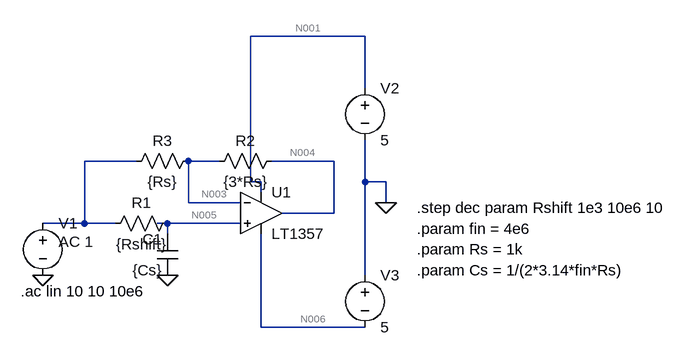
[diagram p0: schematic Draft7.asc]
Draft7.asc, the LTspice schematic file:
Version 4
SHEET 1 936 680
WIRE 400 -128 224 -128
WIRE 400 -48 400 -128
WIRE 48 64 -32 64
WIRE 176 64 128 64
WIRE 352 64 256 64
WIRE 224 96 224 -128
WIRE 240 96 224 96
WIRE 400 96 400 32
WIRE 432 96 400 96
WIRE 240 112 240 96
WIRE 128 128 128 64
WIRE 208 128 128 128
WIRE 432 128 432 96
WIRE 352 144 352 64
WIRE 352 144 272 144
WIRE -32 160 -32 64
WIRE -32 160 -96 160
WIRE 16 160 -32 160
WIRE 96 160 80 160
WIRE 208 160 96 160
WIRE 96 176 96 160
WIRE 400 240 400 96
WIRE 240 320 240 176
WIRE 400 320 240 320
FLAG -96 240 0
FLAG 96 240 0
FLAG 432 128 0
SYMBOL cap 112 240 R180
WINDOW 0 24 56 Left 2
WINDOW 3 24 8 Left 2
SYMATTR InstName C1
SYMATTR Value {Cs}
SYMBOL res 112 144 R90
WINDOW 0 0 56 VBottom 2
WINDOW 3 32 56 VTop 2
SYMATTR InstName R1
SYMATTR Value {Rshift}
SYMBOL voltage -96 144 R0
WINDOW 3 24 96 Invisible 2
WINDOW 123 24 44 Left 2
WINDOW 39 0 0 Left 0
SYMATTR InstName V1
SYMATTR Value SINE(0 1 {fin})
SYMATTR Value2 AC 1
SYMBOL OpAmps\\LT1357 240 80 R0
SYMATTR InstName U1
SYMBOL res 272 48 R90
WINDOW 0 0 56 VBottom 2
WINDOW 3 32 56 VTop 2
SYMATTR InstName R2
SYMATTR Value {3*Rs}
SYMBOL res 144 48 R90
WINDOW 0 0 56 VBottom 2
WINDOW 3 32 56 VTop 2
SYMATTR InstName R3
SYMATTR Value {Rs}
SYMBOL voltage 400 -64 R0
WINDOW 123 0 0 Left 0
WINDOW 39 0 0 Left 0
SYMATTR InstName V2
SYMATTR Value 5
SYMBOL voltage 400 224 R0
WINDOW 123 0 0 Left 0
WINDOW 39 0 0 Left 0
SYMATTR InstName V3
SYMATTR Value 5
TEXT 480 200 Left 2 !.param Rs = 1k
TEXT 480 232 Left 2 !.param Cs = 1/(2*3.14*fin*Rs)
TEXT 480 168 Left 2 !.param fin = 4e6
TEXT 480 136 Left 2 !.step dec param Rshift 1e3 10e6 10
TEXT -130 264 Left 2 !.ac lin 10 10 10e6

The netlist it stands for:
* Draft7.asc
C1 0 N005 {Cs}
R1 N005 N002 {Rshift}
V1 N002 0 SINE(0 1 {fin}) AC 1
XU1 N005 N003 N001 N006 N004 LT1357  ; pins In+ In- V+ V- OUT
R2 N004 N003 {3*Rs}
R3 N003 N002 {Rs}
V2 N001 0 5
V3 0 N006 5
.param Rs = 1k
.param Cs = 1/(2*3.14*fin*Rs)
.param fin = 4e6
.step dec param Rshift 1e3 10e6 10
.ac lin 10 10 10e6
.backanno
.end

* Results of the author's LTspice run, read from the files saved beside the schematic
* Operating Point (first step), zero values left out:
*   rshift = 1 k
*   V(n005) = -120.6 µV
*   V(n003) = -120.6 µV
*   V(n001) = 5 V
*   V(n004) = -120.6 µV
*   V(n006) = -5 V
*   I(R1) = -120.6 nA
*   I(R2) = 1.815 pA
*   I(R3) = -120.6 nA
*   I(V1) = -241.2 nA
*   I(V2) = -1.714 mA
*   I(V3) = -1.714 mA
*   Ix(u1:1) = 120.6 nA
*   Ix(u1:2) = 120.6 nA
*   Ix(u1:3) = 1.714 mA
*   Ix(u1:4) = -1.714 mA
*   Ix(u1:5) = -1.815 pA
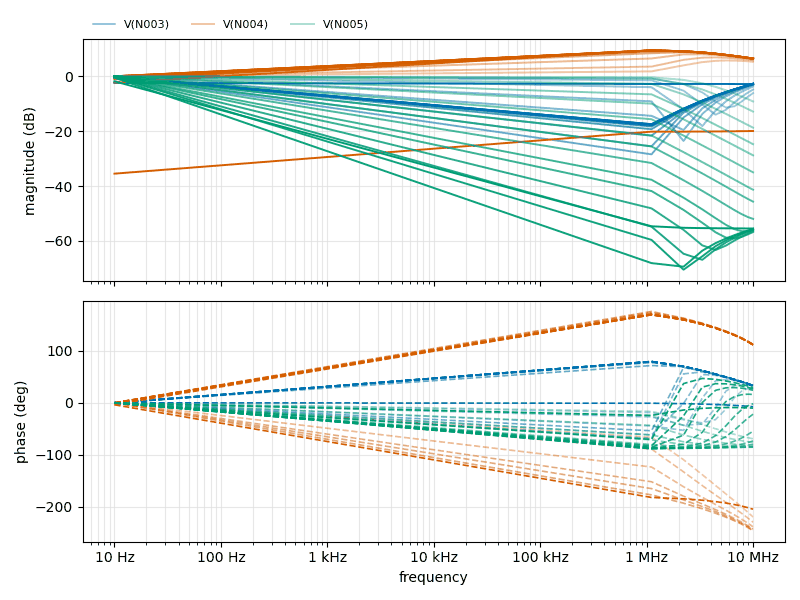
[diagram p1: AC Analysis of Draft7.asc, plotted from the saved traces]
* AC Analysis, 41 runs:
*   V(N003) [run 1]: -0.00 dB at 10 Hz, -6.14 dB at 10 MHz, peak -0.00 dB at 10 Hz, 3 dB below the peak at 2.268 MHz
*   V(N003) [run 2]: -0.00 dB at 10 Hz, -4.85 dB at 10 MHz, peak -0.00 dB at 10 Hz, 3 dB below the peak at 1.473 MHz
*   V(N003) [run 3]: -0.00 dB at 10 Hz, -3.75 dB at 10 MHz, peak -0.00 dB at 10 Hz, 3 dB below the peak at 65.42 kHz
*   V(N003) [run 4]: -0.00 dB at 10 Hz, -3.22 dB at 10 MHz, peak -0.00 dB at 10 Hz, 3 dB below the peak at 458.9 Hz
*   V(N003) [run 5]: -0.00 dB at 10 Hz, -3.04 dB at 10 MHz, peak -0.00 dB at 10 Hz, 3 dB below the peak at 113.2 Hz
*   V(N003) [run 6]: -0.00 dB at 10 Hz, -2.88 dB at 10 MHz, peak -0.00 dB at 10 Hz, 3 dB below the peak at 34.2 Hz
*   V(N003) [run 7]: -0.00 dB at 10 Hz, -2.81 dB at 10 MHz, peak -0.00 dB at 10 Hz, 3 dB below the peak at 39.36 Hz
*   V(N003) [run 8]: -0.01 dB at 10 Hz, -2.78 dB at 10 MHz, peak -0.01 dB at 10 Hz, 3 dB below the peak at 50.3 Hz
*   V(N004) [run 1]: -0.00 dB at 10 Hz, 5.28 dB at 10 MHz, peak 5.75 dB at 5.556 MHz, 3 dB below the peak at 1.505 MHz
*   V(N004) [run 2]: -0.00 dB at 10 Hz, 5.81 dB at 10 MHz, peak 6.88 dB at 4.444 MHz, 3 dB below the peak at 1.225 MHz
*   V(N004) [run 3]: -0.00 dB at 10 Hz, 6.17 dB at 10 MHz, peak 8.03 dB at 3.333 MHz, 3 dB below the peak at 79.81 kHz
*   V(N004) [run 4]: -0.00 dB at 10 Hz, 6.32 dB at 10 MHz, peak 8.74 dB at 2.222 MHz, 3 dB below the peak at 28.36 kHz
*   V(N004) [run 5]: -0.00 dB at 10 Hz, 6.36 dB at 10 MHz, peak 8.95 dB at 1.111 MHz, 3 dB below the peak at 22.38 kHz
*   V(N004) [run 6]: -0.01 dB at 10 Hz, 6.40 dB at 10 MHz, peak 9.28 dB at 1.111 MHz, 3 dB below the peak at 25.78 kHz
*   V(N004) [run 7]: -0.02 dB at 10 Hz, 6.42 dB at 10 MHz, peak 9.38 dB at 1.111 MHz, 3 dB below the peak at 26.88 kHz
*   V(N004) [run 8]: -0.03 dB at 10 Hz, 6.42 dB at 10 MHz, peak 9.40 dB at 1.111 MHz, 3 dB below the peak at 27.23 kHz
*   V(N005) [run 1]: -0.00 dB at 10 Hz, -9.19 dB at 10 MHz, peak -0.00 dB at 10 Hz, 3 dB below the peak at 3.679 MHz
*   V(N005) [run 2]: -0.00 dB at 10 Hz, -12.87 dB at 10 MHz, peak -0.00 dB at 10 Hz, 3 dB below the peak at 2.325 MHz
*   V(N005) [run 3]: -0.00 dB at 10 Hz, -18.73 dB at 10 MHz, peak -0.00 dB at 10 Hz, 3 dB below the peak at 1.16 MHz
*   V(N005) [run 4]: -0.00 dB at 10 Hz, -24.75 dB at 10 MHz, peak -0.00 dB at 10 Hz, 3 dB below the peak at 2.018 kHz
*   V(N005) [run 5]: -0.00 dB at 10 Hz, -28.82 dB at 10 MHz, peak -0.00 dB at 10 Hz, 3 dB below the peak at 332.9 Hz
*   V(N005) [run 6]: -0.00 dB at 10 Hz, -35.01 dB at 10 MHz, peak -0.00 dB at 10 Hz, 3 dB below the peak at 93.53 Hz
*   V(N005) [run 7]: -0.00 dB at 10 Hz, -41.35 dB at 10 MHz, peak -0.00 dB at 10 Hz, 3 dB below the peak at 50.61 Hz
*   V(N005) [run 8]: -0.01 dB at 10 Hz, -45.68 dB at 10 MHz, peak -0.01 dB at 10 Hz, 3 dB below the peak at 39.28 Hz